# Altium schematic sheet EE311_Charger.SchDoc: ELECTENG 311 - Boost Converter
size A3; Author: Duleepa J Thrimawithana; Organization: Power Electronics Group; Address1: The University of Auckland; Address2: 20 Symonds Street; Address3: Auckland 1010; Address4: New Zealand; Revision: 1R1; SheetNumber: 1; SheetTotal: 1
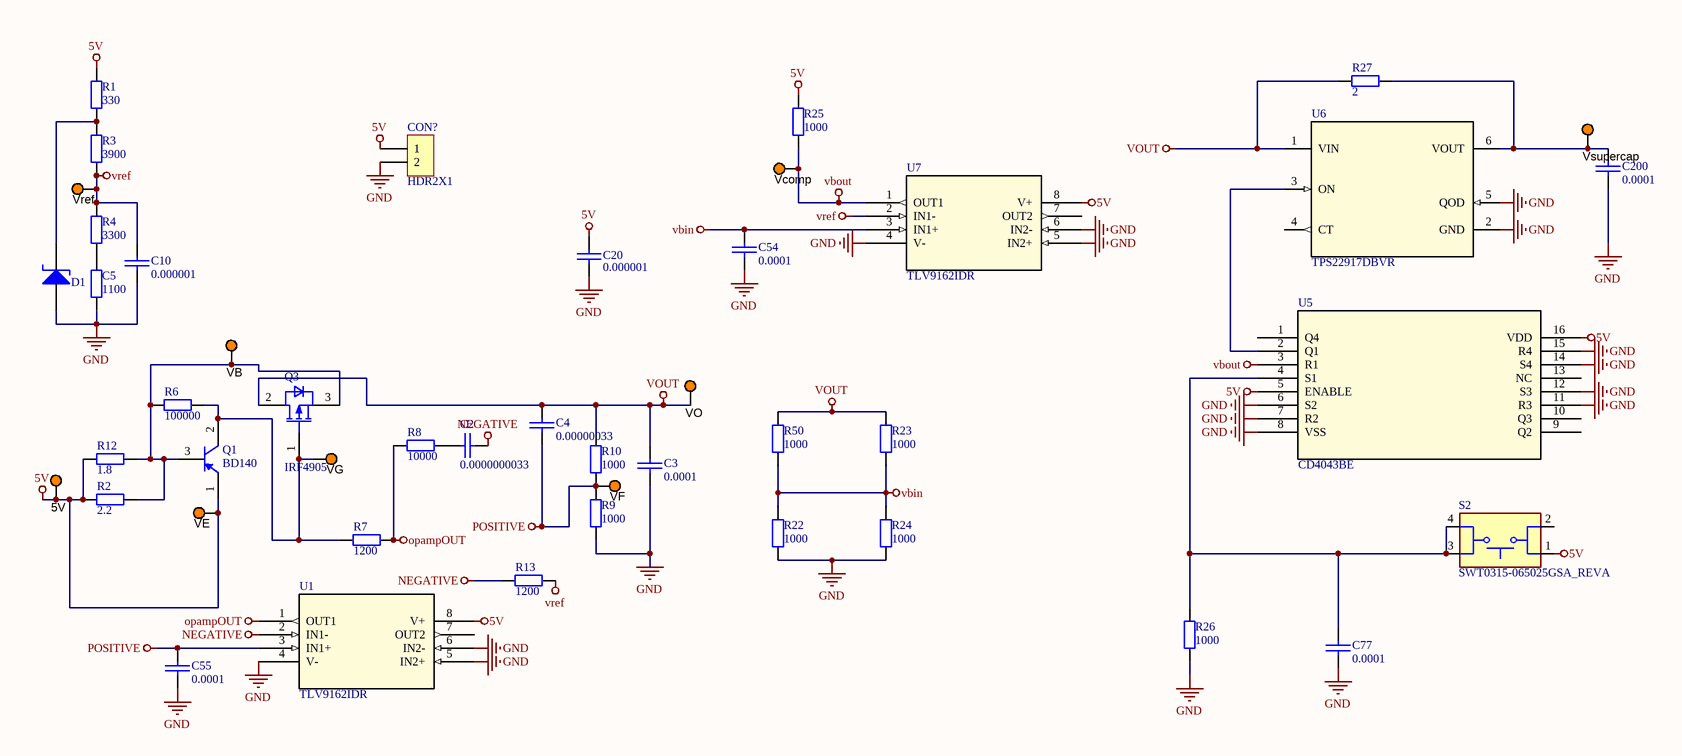
[diagram p0: EE311_Charger.SchDoc]

## Parts
5V  5003  [TP_TH]  (value not drawn)
C2  0.0000000033  [0805 CAP]
C3  0.0001  [0805 CAP]
C4  0.00000033  [0805 CAP]
C5  1100  [0805 RES]
C10  0.000001  [0805 CAP]
C20  0.000001  [0805 CAP]
C54  0.0001  [0805 CAP]
C55  0.0001  [0805 CAP]
C77  0.0001  [0805 CAP]
C200  0.0001  [0805 CAP]
CON?  HDR2X1  [HDR2X1_2P54]
D1  BZT52H-B4V7  [SOD123]  (value not drawn)
Q1  BD140  [ONSC-TO-225-3-77-09]
Q3  IRF4905  [IFX-PG-TO220-3-904-1]
R1  330  [0805 RES]
R2  2.2  [0805 RES]
R3  3900  [0805 RES]
R4  3300  [0805 RES]
R6  100000  [0805 RES]
R7  1200  [0805 RES]
R8  10000  [0805 RES]
R9  1000  [0805 RES]
R10  1000  [0805 RES]
R12  1.8  [0805 RES]
R13  1200  [0805 RES]
R22  1000  [0805 RES]
R23  1000  [0805 RES]
R24  1000  [0805 RES]
R25  1000  [0805 RES]
R26  1000  [0805 RES]
R27  2  [0805 RES]
R50  1000  [0805 RES]
S2  SWT0315-065025GSA_REVA  [SW_SWT0315-065025GSA_REVA]
U1  TLV9162IDR  [SOIC8_D_TEX]
U5  CD4043BE  [N16]
U6  TPS22917DBVR  [DBV0006_N]
U7  TLV9162IDR  [SOIC8_D_TEX]
VB  5003  [TP_TH]  (value not drawn)
Vcomp  5003  [TP_TH]  (value not drawn)
VE  5003  [TP_TH]  (value not drawn)
VF  5003  [TP_TH]  (value not drawn)
VG  5003  [TP_TH]  (value not drawn)
VO  5003  [TP_TH]  (value not drawn)
Vref  5003  [TP_TH]  (value not drawn)
Vsupercap  5003  [TP_TH]  (value not drawn)

## Nets
5V: 5V.1 C20.1 CON?.1 Q1.1(E) R1.2 R2.1 R12.1 R25.2 S2.1 U1.8(V+) U5.5(ENABLE) U5.16(VDD) U7.8(V+) VE.1
GND: C3.2 C5.2 C10.2 C20.2 C54.2 C55.2 C77.2 C200.2 CON?.2 D1.1(A) R9.1 R22.1 R24.1 R26.1 U1.4(V-) U1.5(IN2+) U1.6(IN2-) U5.6(S2) U5.7(R2) U5.8(VSS) U5.11(R3) U5.12(S3) U5.14(S4) U5.15(R4) U6.2(GND) U6.5(QOD) U7.4(V-) U7.5(IN2+) U7.6(IN2-)
NEGATIVE: C2.1 R13.1 U1.2(IN1-)
opampOUT: R7.2 R8.1 U1.1(OUT1)
POSITIVE: C4.2 C55.1 R9.2 R10.1 U1.3(IN1+) VF.1
vbin: C54.1 R22.2 R23.2 R24.2 R50.1 U7.3(IN1+)
vbout: R25.1 U5.3(R1) U7.1(OUT1) Vcomp.1
VOUT: C3.1 C4.1 Q3.2(DRAIN) R10.2 R23.1 R27.1 R50.2 U6.1(VIN) VO.1
vref: C10.1 R3.2 R4.1 R13.2 U7.2(IN1-) Vref.1
NetC2_2: C2.2 R8.2
NetC5_1: C5.1 R4.2
NetC77_1: C77.1 R26.2 S2.3 S2.4 U5.4(S1)
NetC200_1: C200.1 R27.2 U6.6(VOUT) Vsupercap.1
NetD1_2: D1.2(K) R1.1 R3.1
NetQ1_2: Q1.2(C) Q3.1(GATE) R6.2 R7.1 VG.1
NetQ1_3: Q1.3(B) Q3.3(SOURCE) R2.2 R6.1 R12.2 VB.1
NetU5_2: U5.2(Q1) U6.3(ON)

Not connected (* = marked no-connect by the designer): S2 2; U1 7(OUT2); U5 1(Q4) 9(Q2) 10(Q3) 13(NC); U6 4(CT); U7 7(OUT2)

## Notes on the sheet
- Title:
- Author:
- Date:
- Time:
- Revision:
- Sheet
- of
- File:

## Library data of the parts
5V VB Vcomp VE VF VG VO Vref Vsupercap = TestPoint: Test Point, Orange, 1-Pin THD, RoHS; Peak Reverse Current: 600 uA; Forward Current: 3 A; Max Surge Current: 80 A; Forward Voltage: 1.08 V; Max Operating Temperature: 150 degC; PackageReference: 5003; Pins: 2; ComponentLink2URL: http://keyelco.com/userAssets/file/M65p56.pdf; PackageDescription: 1-Pin Through Hole Device, Dia 2.54 mm; Weight: 0.01 lb; Diameter: 5.3 mm; Mount: Through Hole; Package Quantity: 500; Packaging: Bulk; Min Operating Temperature: -65 degC; ComponentLink1Description: Manufacturer URL; Height: 0.25 inch; ComponentLink1URL: http://www.keyelco.com/; ComponentLink2Description: Datasheet; Width: 0.25 inch; REACH SVHC: No SVHC; RoHSCompliant: true; Radiation Hardening: No; Length: 9.5 mm; DatasheetVersion: Jun-15
C2-C4 C10 C20 C54 C55 C77 C200 = CerCap_SMT_0805: SMT ceramic capacitor 0805 size; Value: *
C5 R1-R4 R6-R10 R12 R13 R22-R27 R50 = Res_SMT_0805: 0805 resistor; Published: 8-Jun-2000; LatestRevisionDate: 17-Jul-2002; LatestRevisionNote: Re-released for DXP Platform.; PackageReference: AXIAL-0.4; Publisher: Altium Limited; Value: *; ComponentLink1Description: https://nz.mouser.com/datasheet/2/315/AOA0000C304-1149620.pdf
CON? = CMP-004-000000-7: Header 2X1; Design Item ID: HDR2X1; Source: CommonSymbols_V1.SchLib; Component Type: Connectors
D1 = Zener_SMT_SOD123: SMT zener diode with SOD123 package; Manufacturer: Nexperia USA Inc.; Manufacturer Part Number: BZT52H-B4V7,115; Tolerance: ±2%; Supplier 1: Digi-Key; RoHS: RoHS Compliant; Category: Discrete Semiconductor Products; Stock 1: 0; Pricing 1: 1=0.51, 10=0.408, 100=0.2164, 500=0.14232, 1000=0.09678 (NZD); Packaging: Cut Tape (CT); Part Status: Active; Operating Temperature: -65°C ~ 150°C (TA); Mounting Type: Surface Mount; Package / Case: SOD-123F; Supplier Device Package: SOD-123F; ComponentLink1URL: https://assets.nexperia.com/documents/data-sheet/BZT52H_SER.pdf; ComponentLink1Description: https://assets.nexperia.com/documents/data-sheet/BZT52H_SER.pdf; Supplier Part Number 1: 1727-1611-1-ND
Q1 = CMP-1048-00039-1: Plastic Medium-Power Silicon PNP Transistor, 3-Pin TO-225, Bulk Box; Manufacturer: On Semiconductor; IC Continuous (A): 1.5; PartNumber: BD140; ComponentLink1Description: Manufacturer URL; RoHS: FALSE; ComponentLink1URL: http://www.onsemi.com/; DatasheetVersion: Rev. 15; ComponentLink2URL: http://www.onsemi.com/pub_link/Collateral/BD136-D.PDF; ComponentLink3Description: Package Specification; Packing: Bulk Box; PackageVersion: Rev. AC, 12/2013; ComponentLink3URL: http://www.onsemi.com/pub_link/Collateral/77-09.PDF; PackageDescription: 3-Pin Flange Mount, Vertical Straight Lead, Body 7.6 x 2.7 mm, Pitch 2.29 mm; Mounting Technology: Through Hole; PackageReference: TO-225-3-77-09; ComponentLink2Description: Datasheet; Polarity: PNP
Q3 = IRF4905: OptiMOS - P2 Power-Transistor, P-channel-Enhancement mode, VDS -30V; Manufacturer: Infineon Technologies; Manufacturer Order NumberManufacturer Order Number: IRF4905; PackageReference: PG-TO220-3-904
S2 = SWT0315-065025GSA_REVA: 6mm x 6mm Gull Wing Tactile Switch; MF: Global Connector Technology; SnapEDA_Link: https://www.snapeda.com/parts/SWT0315-065025GSA/Global+Connector+Technology/view-part/?ref=snap; Package: None; Value: *; MP: SWT0315-065025GSA; Check_prices: https://www.snapeda.com/parts/SWT0315-065025GSA/Global+Connector+Technology/view-part/?ref=eda
U1 U7 = TLV9162IDR: Dual, 16V, 11MHz, rail-to-rail input and output low-offset-voltage low-noise operational amplifier 8-SOIC -40 to 125; Manufacturer_Name: Texas Instruments; Copyright: Copyright (C) 2026 Ultra Librarian. All rights reserved.; Manufacturer_Part_Number: TLV9162IDR; Datasheet: https://www.ti.com/lit/gpn/tlv9162; RefDes: RefDes; Type: Type
U5 = CD4043BE: CMOS Quad NOR R/S Latch with 3-State Outputs 16-PDIP -55 to 125; Manufacturer_Name: Texas Instruments; Copyright: Copyright (C) 2025 Ultra Librarian. All rights reserved.; Manufacturer_Part_Number: CD4043BE; RefDes: RefDes; Type: Type
U6 = TPS22917DBVR: 5.5-V, 2-A, 80-mÎ© , 10-nA leakage load switch adj. rise time and adj output discharge 6-SOT-23 -40 to 125; Manufacturer_Name: Texas Instruments; TYPE: TYPE; RefDes: RefDes; Copyright: Copyright (C) 2026 Ultra Librarian. All rights reserved.; Manufacturer_Part_Number: TPS22917DBVR